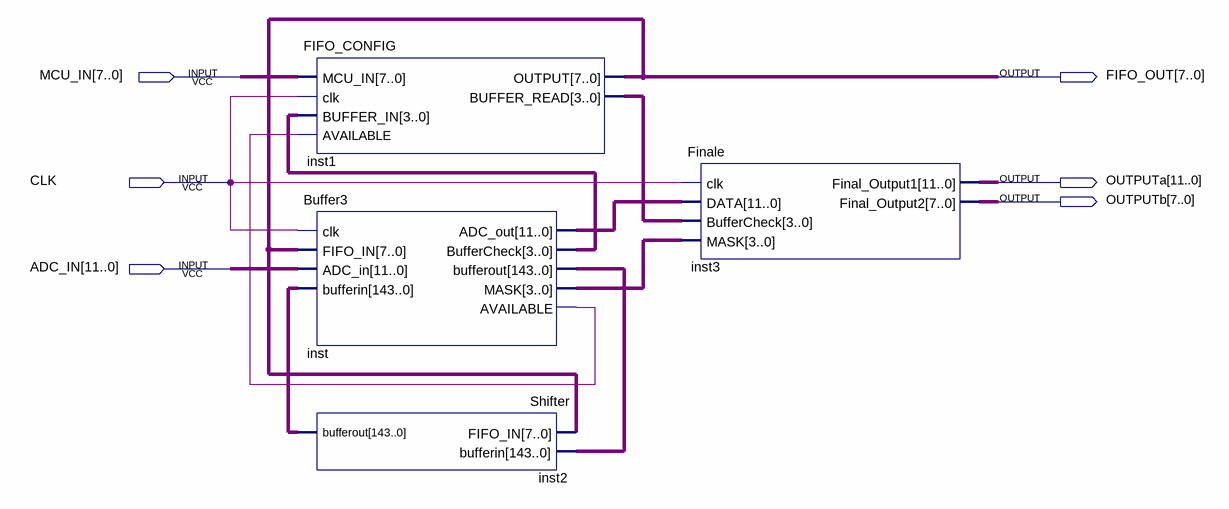
[diagram p0: schematic sheet]
// Quartus schematic P1.bdf as structural Verilog: 4 symbols, 6 pins
module P1 (
  input  [7:0] MCU_IN,
  input  CLK,
  input  [11:0] ADC_IN,
  output [7:0] FIFO_OUT,
  output [11:0] OUTPUTa,
  output [7:0] OUTPUTb
);

  wire inst_available;
  wire [3:0] inst1_buffer_read, inst_buffercheck, inst_mask;
  wire [11:0] inst_adc_out;
  wire [143:0] inst2_bufferout, inst_bufferout;

  FIFO_CONFIG inst1 (
    .MCU_IN(MCU_IN), .clk(CLK), .BUFFER_IN(inst_buffercheck), .AVAILABLE(inst_available), .OUTPUT(FIFO_OUT),
    .BUFFER_READ(inst1_buffer_read));
  Buffer3 inst (
    .clk(CLK), .FIFO_IN(FIFO_OUT), .ADC_in(ADC_IN), .bufferin(inst2_bufferout), .ADC_out(inst_adc_out),
    .BufferCheck(inst_buffercheck), .bufferout(inst_bufferout), .MASK(inst_mask), .AVAILABLE(inst_available));
  Shifter inst2 (.FIFO_IN(FIFO_OUT), .bufferin(inst_bufferout), .bufferout(inst2_bufferout));
  Finale inst3 (
    .clk(CLK), .DATA(inst_adc_out), .BufferCheck(inst1_buffer_read), .MASK(inst_mask),
    .Final_Output1(OUTPUTa), .Final_Output2(OUTPUTb));
endmodule
